# EAGLE schematic Transceivers_Ver2 (EAGLE 7.1.0)
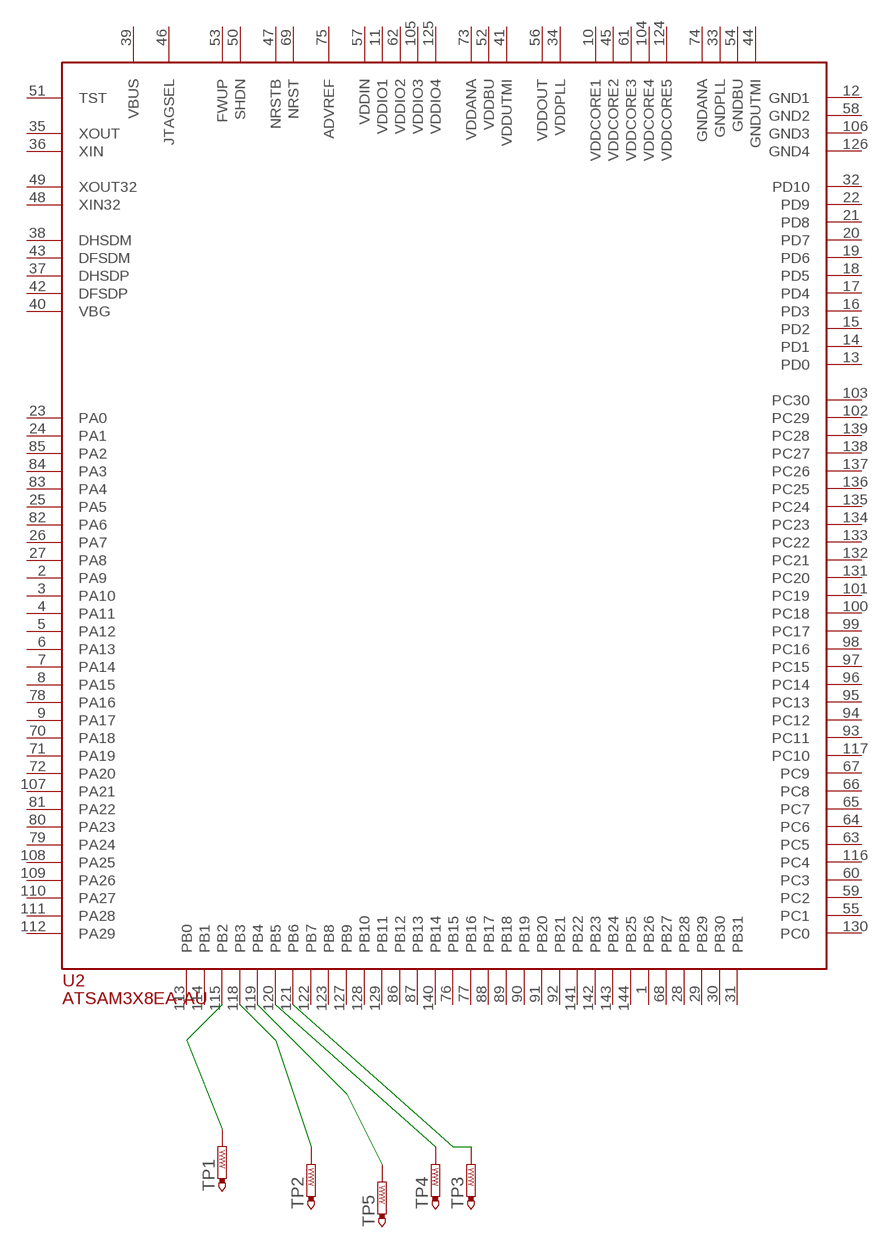
[diagram p0: schematic, sheet 1, part 1 of 2]
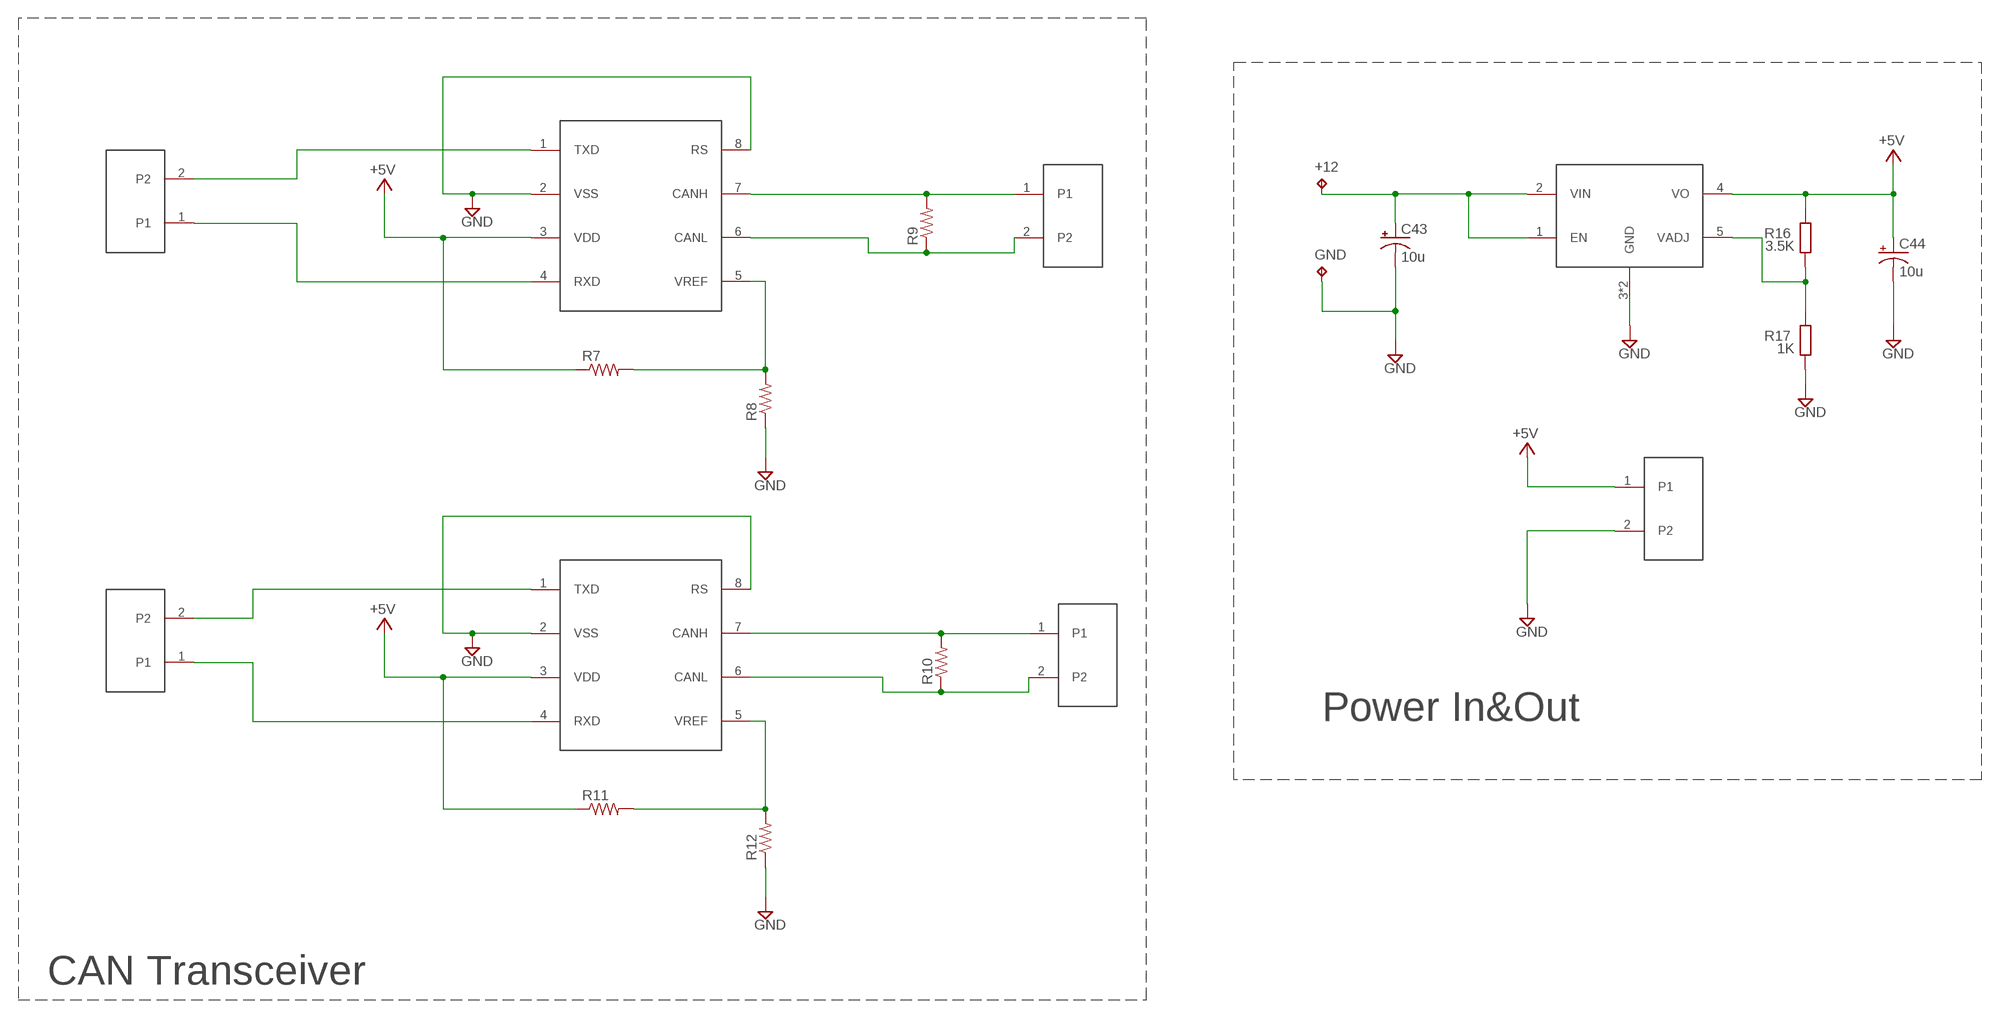
[diagram p1: schematic, sheet 1, part 2 of 2]

## Parts
+12  TPPAD1-13  [P1-13]
C43  10u  CPOL-US153CLV-0405  [153CLV-0405]
C44  10u  CPOL-US153CLV-0405  [153CLV-0405]
CAN0  CON-100MIL  [2X1-100MIL]
CAN1  CON-100MIL  [2X1-100MIL]
GND  TPPAD1-13  [P1-13]
POWER  CON-100MIL  [2X1-100MIL]
R7  R-US_R0805  [R0805]
R8  R-US_R0805  [R0805]
R9  R-US_R0805  [R0805]
R10  R-US_R0805  [R0805]
R11  R-US_R0805  [R0805]
R12  R-US_R0805  [R0805]
R16  3.5K  R-EU_R0805  [R0805]
R17  1K  R-EU_R0805  [R0805]
TP1  PTR1PAD1-13Y  [P1-13Y]
TP2  PTR1PAD1-13Y  [P1-13Y]
TP3  PTR1PAD1-13Y  [P1-13Y]
TP4  PTR1PAD1-13Y  [P1-13Y]
TP5  PTR1PAD1-13Y  [P1-13Y]
TXRX0  CON-100MIL  [2X1-100MIL]
TXRX1  CON-100MIL  [2X1-100MIL]
U1  MCP2551  [SOIC8]
U2  ATSAM3X8EA-AU  ATSAM3X/AAU  [LQFP144]
U4  MCP2551  [SOIC8]
U5  TLF1963TBATMA1  TLF1963  [DPAK]

## Nets
+5V: C44.+ POWER.1 R7.1 R11.1 R16.2 U1.3(VDD) U4.3(VDD) U5.4(VO)
CH0: CAN0.1 R9.2 U1.7(CANH)
CH1: CAN1.1 R10.2 U4.7(CANH)
CL0: CAN0.2 R9.1 U1.6(CANL)
CL1: CAN1.2 R10.1 U4.6(CANL)
GND: C43.- C44.- GND.TP POWER.2 R8.1 R12.1 R17.1 U1.2(VSS) U1.8(RS) U4.2(VSS) U4.8(RS) U5.3(GND) U5.6(GND)
N$1: TP1.TP U2.115(PB2)
N$2: TP2.TP U2.118(PB3)
N$3: R7.2 R8.2 U1.5(VREF)
N$4: TP5.TP U2.119(PB4)
N$5: TP4.TP U2.120(PB5)
N$6: TP3.TP U2.121(PB6)
N$7: R11.2 R12.2 U4.5(VREF)
N$13: +12.TP C43.+ U5.1(EN) U5.2(VIN)
N$15: R16.1 R17.2 U5.5(VADJ)
RX0: TXRX0.1 U1.4(RXD)
RX1: TXRX1.1 U4.4(RXD)
TX0: TXRX0.2 U1.1(TXD)
TX1: TXRX1.2 U4.1(TXD)
Unconnected: U2.1(PB26) U2.2(PA9) U2.3(PA10) U2.4(PA11) U2.5(PA12) U2.6(PA13) U2.7(PA14) U2.8(PA15) U2.9(PA17) U2.10(VDDCORE1) U2.13(PD0) U2.14(PD1) U2.15(PD2) U2.16(PD3) U2.17(PD4) U2.18(PD5) U2.19(PD6) U2.20(PD7) U2.21(PD8) U2.22(PD9) U2.23(PA0) U2.24(PA1) U2.25(PA5) U2.26(PA7) U2.27(PA8) U2.28(PB28) U2.29(PB29) U2.30(PB30) U2.31(PB31) U2.32(PD10) U2.34(VDDPLL) U2.35(XOUT) U2.36(XIN) U2.37(DHSDP) U2.38(DHSDM) U2.40(VBG) U2.41(VDDUTMI) U2.42(DFSDP) U2.43(DFSDM) U2.45(VDDCORE2) U2.46(JTAGSEL) U2.47(NRSTB) U2.48(XIN32) U2.49(XOUT32) U2.50(SHDN) U2.51(TST) U2.53(FWUP) U2.55(PC1) U2.56(VDDOUT) U2.59(PC2) U2.60(PC3) U2.61(VDDCORE3) U2.63(PC5) U2.64(PC6) U2.65(PC7) U2.66(PC8) U2.67(PC9) U2.68(PB27) U2.69(NRST) U2.70(PA18) U2.71(PA19) U2.72(PA20) U2.76(PB15) U2.77(PB16) U2.78(PA16) U2.79(PA24) U2.80(PA23) U2.81(PA22) U2.82(PA6) U2.83(PA4) U2.84(PA3) U2.85(PA2) U2.86(PB12) U2.87(PB13) U2.88(PB17) U2.89(PB18) U2.90(PB19) U2.91(PB20) U2.92(PB21) U2.93(PC11) U2.94(PC12) U2.95(PC13) U2.96(PC14) U2.97(PC15) U2.98(PC16) U2.99(PC17) U2.100(PC18) U2.101(PC19) U2.102(PC29) U2.103(PC30) U2.104(VDDCORE4) U2.107(PA21) U2.108(PA25) U2.109(PA26) U2.110(PA27) U2.111(PA28) U2.112(PA29) U2.113(PB0) U2.114(PB1) U2.116(PC4) U2.117(PC10) U2.122(PB7) U2.123(PB8) U2.124(VDDCORE5) U2.127(PB9) U2.128(PB10) U2.129(PB11) U2.130(PC0) U2.131(PC20) U2.132(PC21) U2.133(PC22) U2.134(PC23) U2.135(PC24) U2.136(PC25) U2.137(PC26) U2.138(PC27) U2.139(PC28) U2.140(PB14) U2.141(PB22) U2.142(PB23) U2.143(PB24) U2.144(PB25)

## Notes on the sheet
- Power In&Out
- CAN Transceiver

## Power pins joined to a net without a drawn wire
ADVREF: U2.75(ADVREF)
GND1: U2.12(GND1)
GND2: U2.58(GND2)
GND3: U2.106(GND3)
GND4: U2.126(GND4)
GNDANA: U2.74(GNDANA)
GNDBU: U2.54(GNDBU)
GNDPLL: U2.33(GNDPLL)
GNDUTMI: U2.44(GNDUTMI)
VBUS: U2.39(VBUS)
VDDANA: U2.73(VDDANA)
VDDBU: U2.52(VDDBU)
VDDIN: U2.57(VDDIN)
VDDIO1: U2.11(VDDIO1)
VDDIO2: U2.62(VDDIO2)
VDDIO3: U2.105(VDDIO3)
VDDIO4: U2.125(VDDIO4)

## Library data of the parts
+12 GND = testpad:TP: Test pad
C43 C44 = Dash parts:CPOL-US: POLARIZED CAPACITOR, American symbol; EEE-FPV100UAR: 10u
CAN0 CAN1 POWER TXRX0 TXRX1 = Dash parts:CON-100MIL
R7-R12 = resistor:R-US_: RESISTOR, American symbol
R16 = SmartPrj:R-EU_: RESISTOR, European symbol; SMD: 3.5K, 1%
R17 = SmartPrj:R-EU_: RESISTOR, European symbol; SMD: 1K, 1%
TP1-TP5 = testpad:PTR1: TEST PIN
U1 U4 = Dash parts:MCP2551
U2 = SmartPrj:ATSAM3X/A
U5 = Dash parts:TLF1963

## Net classes
0 default: width 0.203 mm, drill 0.406 mm, clearance 0.203 mm
3 usbvcc: width 0.203 mm, drill 0.406 mm, clearance 0.203 mm
4 USBpair: width 0.254 mm, drill 0.406 mm, clearance 0.61 mm